# EAGLE design loochi-0.5 (EAGLE 6.2)
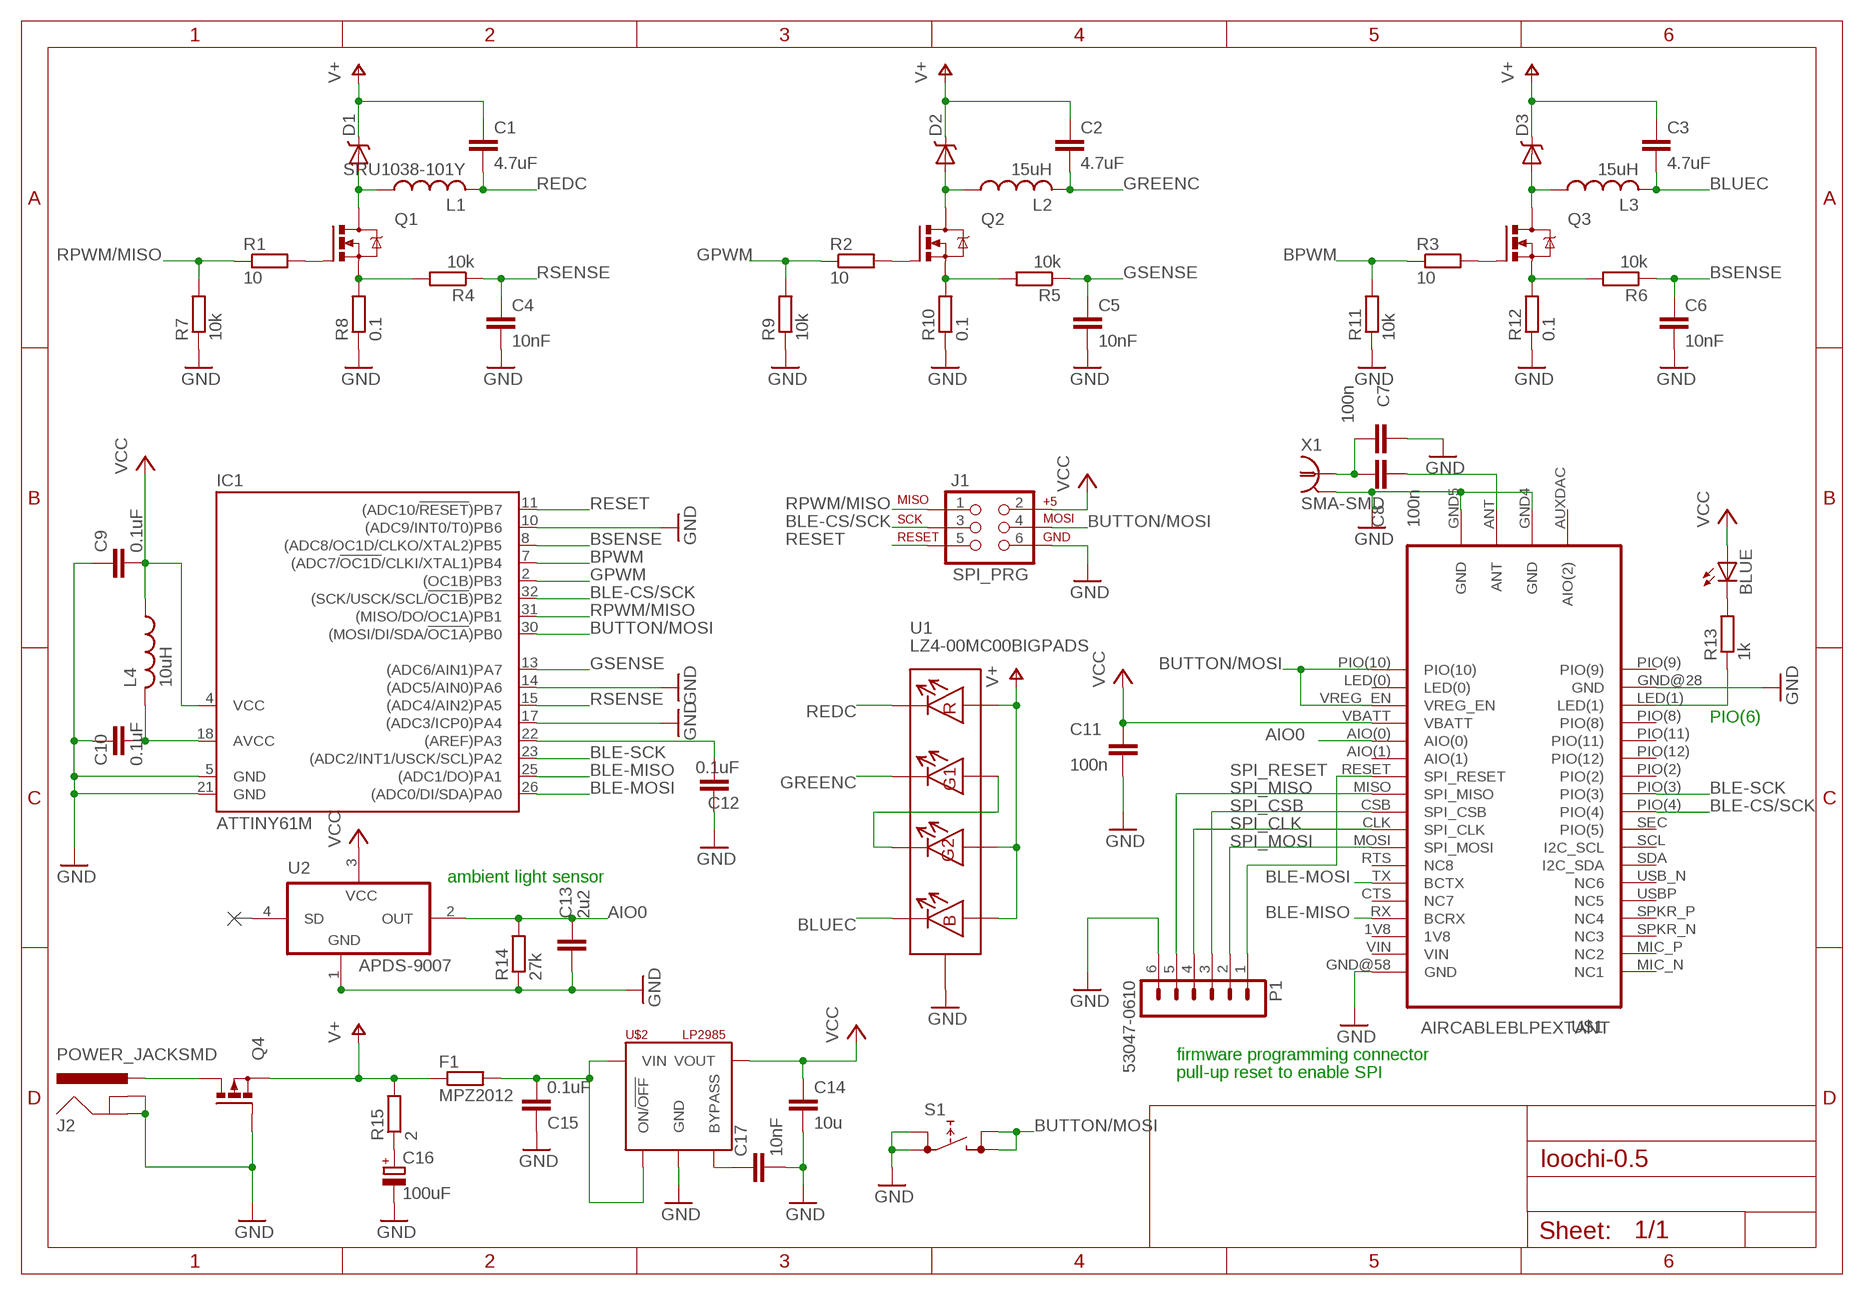
[diagram p0: schematic, sheet 1]

## Parts
BLUE  500003  [CHIPLED_0603]
C1  4.7uF  C-EUC0603  [C0603]
C2  4.7uF  C-EUC0603  [C0603]
C3  4.7uF  C-EUC0603  [C0603]
C4  10nF  C-EUC0603  [C0603]
C5  10nF  C-EUC0603  [C0603]
C6  10nF  C-EUC0603  [C0603]
C7  100n  C-EUC0603  [C0603]
C8  100n  C-EUC0603  [C0603]
C9  0.1uF  C-EUC0603  [C0603]
C10  0.1uF  C-EUC0603  [C0603]
C11  100n  C-EUC0603  [C0603]
C12  0.1uF  C-EUC0603  [C0603]
C13  2u2  C-EUC0603  [C0603]
C14  10u  C-EUC0603  [C0603]
C15  0.1uF  C-EUC0603K  [C0603K]
C16  100uF  CPOL-EUD  [PANASONIC_D]
C17  10nF  C-EUC0603  [C0603]
D1  PMEG4010CEH  DIODE-SCHOTTKY  [SOD123F]
D2  PMEG4010CEH  DIODE-SCHOTTKY  [SOD123F]
D3  PMEG4010CEH  DIODE-SCHOTTKY  [SOD123F]
F1  MPZ2012  R-EU_R0603  [R0603]
IC1  ATTINY61M  [MLF32]
J1  SPI_PRG  AVR_SPI_PRG_6NS  [2X3-NS]
J2  POWER_JACKSMD  [POWER_JACK_SMD]
L1  SRU1038-101Y  L-USBOURNS-SRU1038  [BOURNS-SRU1038]
L2  15uH  L-USBOURNS-SRU1038  [BOURNS-SRU1038]
L3  15uH  L-USBOURNS-SRU1038  [BOURNS-SRU1038]
L4  10uH  L-USL0603  [L0603]
P1  53047-0610  [53047-0610]
Q1  PMN25ENSOT457  [SOT457]
Q2  PMN25ENSOT457  [SOT457]
Q3  PMN25ENSOT457  [SOT457]
Q4  FDC654P  [SUPERSOT6]
R1  10  R-EU_R0603  [R0603]
R2  10  R-EU_R0603  [R0603]
R3  10  R-EU_R0603  [R0603]
R4  10k  R-EU_R0603  [R0603]
R5  10k  R-EU_R0603  [R0603]
R6  10k  R-EU_R0603  [R0603]
R7  10k  R-EU_R0603  [R0603]
R8  0.1  R-EU_R0603  [R0603]
R9  10k  R-EU_R0603  [R0603]
R10  0.1  R-EU_R0603  [R0603]
R11  10k  R-EU_R0603  [R0603]
R12  0.1  R-EU_R0603  [R0603]
R13  1k  R-EU_R0603  [R0603]
R14  27k  R-EU_R0603  [R0603]
R15  2  R-EU_R0603  [R0603]
S1  REKN  [TACTSWITCHHORIZONTAL]
U1  LZ4-00MC00BIGPADS  [LZ4-00MC00-BIGPADS]
U2  APDS-9007  [APDS-9007]
U$1  AIRCABLEBLPEXTANT  [AIRCABLEBLP]
U$2  LP2985  [DBV]
X1  SMA-SMD  [SMA-SMD]

## Nets
AIO0: C13.1 R14.2 U2.2(OUT) U$1.AIO(0)
BLE-CS/SCK: IC1.32((SCK/USCK/SCL/!OC1B!)PB2) J1.3 U$1.PIO(4)
BLE-MISO: IC1.25((ADC1/DO)PA1) U$1.RX(BCRX)
BLE-MOSI: IC1.26((ADC0/DI/SDA)PA0) U$1.TX(BCTX)
BLE-SCK: IC1.23((ADC2/INT1/USCK/SCL)PA2) U$1.PIO(3)
BLUEC: C3.2 L3.P$2 U1.P$8
BPWM: IC1.7((ADC7/!OC1D!/CLKI/XTAL1)PB4) R3.1 R11.2
BSENSE: C6.1 IC1.8((ADC8/OC1D/CLKO/XTAL2)PB5) R6.1
BUTTON/MOSI: IC1.30((MOSI/DI/SDA/!OC1A!)PB0) J1.4 S1.3 S1.4 U$1.PIO(10) U$1.VREG_EN
GND: C4.2 C5.2 C6.2 C7.2 C9.1 C10.1 C11.1 C12.1 C13.2 C14.2 C15.1 C16.- C17.2 IC1.5(GND) IC1.10((ADC9/INT0/T0)PB6) IC1.14((ADC5/AIN0)PA6) IC1.17((ADC3/ICP0)PA4) IC1.21(GND) J1.6 J2.GND(GNDBREAK) J2.P$4(GND) P1.6 Q4.P$3(G) R7.1 R8.1 R9.1 R10.1 R11.1 R12.1 R14.1 S1.1 S1.2 U1.P$9(THERMAL) U1.THERMAL U1.THERMAL1(THERMAL) U1.THERMAL2(THERMAL) U1.THERMAL3(THERMAL) U1.THERMAL4(THERMAL) U1.THERMAL5(THERMAL) U1.THERMAL6(THERMAL) U1.THERMAL7(THERMAL) U1.THERMAL8(THERMAL) U1.THERMAL9(THERMAL) U2.1(GND) U$1.GND4(GND) U$1.GND5(GND) U$1.GND@28(GND) U$1.GND@58(GND) U$2.2(GND) X1.2@1(GND)
GPWM: IC1.2((OC1B)PB3) R2.1 R9.2
GREENC: C2.2 L2.P$2 U1.P$6
GSENSE: C5.1 IC1.13((ADC6/AIN1)PA7) R5.1
N$1: U1.P$2 U1.P$5
N$2: C8.1 U$1.ANT
N$3: Q3.P$3(G) R3.2
N$4: Q2.P$3(G) R2.2
N$5: Q1.P$3(G) R1.2
N$7: Q1.P$4(S) R4.2 R8.2
N$8: D1.P$A(A) L1.P$1 Q1.P$1(D) Q1.P$2(D) Q1.P$5(D) Q1.P$6(D)
N$9: C12.2 IC1.22((AREF)PA3)
N$10: J2.VIN0(PWR) J2.VIN1(PWR) Q4.P$1(D) Q4.P$2(D) Q4.P$5(D) Q4.P$6(D)
N$11: C10.2 IC1.18(AVCC) L4.2
N$12: BLUE.C R13.2
N$13: C17.1 U$2.4(BYPASS)
N$14: D2.P$A(A) L2.P$1 Q2.P$1(D) Q2.P$2(D) Q2.P$5(D) Q2.P$6(D)
N$15: C7.1 C8.2 X1.1
N$16: R13.1 U$1.LED(1)
N$17: Q2.P$4(S) R5.2 R10.2
N$21: C16.+ R15.1
N$22: C15.2 F1.2 U$2.1(VIN) U$2.3(ON/!OFF!)
N$23: D3.P$A(A) L3.P$1 Q3.P$1(D) Q3.P$2(D) Q3.P$5(D) Q3.P$6(D)
N$25: Q3.P$4(S) R6.2 R12.2
REDC: C1.2 L1.P$2 U1.P$4
RESET: IC1.11((ADC10/!RESET!)PB7) J1.5
RPWM/MISO: IC1.31((MISO/DO/OC1A)PB1) J1.1 R1.1 R7.2
RSENSE: C4.1 IC1.15((ADC4/AIN2)PA5) R4.1
SPI_CLK: P1.4 U$1.CLK(SPI_CLK)
SPI_CSB: P1.3 U$1.CSB(SPI_CSB)
SPI_MISO: P1.5 U$1.MISO(SPI_MISO)
SPI_MOSI: P1.2 U$1.MOSI(SPI_MOSI)
SPI_RESET: P1.1 U$1.RESET(SPI_RESET)
V+: C1.1 C2.1 C3.1 D1.P$C(C) D2.P$C(C) D3.P$C(C) F1.1 Q4.P$4(S) R15.2 U1.P$1 U1.P$3 U1.P$7
VCC: BLUE.A C9.2 C11.2 C14.1 IC1.4(VCC) J1.2 L4.1 U2.3(VCC) U$1.VBATT U$2.5(VOUT)
Unconnected: U2.4(SD) U$1.1V8 U$1.AIO(1) U$1.AUXDAC(AIO(2)) U$1.CTS(NC7) U$1.LED(0) U$1.MIC_N(NC1) U$1.MIC_P(NC2) U$1.PIO(2) U$1.PIO(8) U$1.PIO(9) U$1.PIO(11) U$1.PIO(12) U$1.RTS(NC8) U$1.SCL(I2C_SCL) U$1.SDA(I2C_SDA) U$1.SEC(PIO(5)) U$1.SPKR_N(NC3) U$1.SPKR_P(NC4) U$1.USB_N(NC6) U$1.USBP(NC5) U$1.VIN

## Notes on the sheet
- PIO(6)
- ambient light sensor
- firmware programming connector
- pull-up reset to enable SPI

## Power pins joined to a net without a drawn wire
GND: X1.2@2(GND) X1.2@3(GND) X1.2@4(GND) X1.2@5(GND) X1.2@6(GND)

## Library data of the parts
BLUE = WCI:500003: LED OSRAM: - CHIPLED LG R971, LG N971, LY N971, LG Q971, LY Q971, LO R971, LY R971 LH N974, LH R974 LS Q976, LO Q976, LY Q976 LO Q996 - Hyper CHIPLED LW Q18S LB Q993, LB Q99A, LB R99A - SideLED LS A670, LO A670, LY A670, LG A670, LP A670 LB A673, LV A673, LT A673, LW A673 LH A674 LY A675 LS A676, LA A676, LO A676, LY A676, LW A676 LS A679, LY A679, LG A679 - Hyper Micro SIDELED® LS Y876, LA Y876, LO Y876, LY Y876 LT Y87S - SmartLED LW L88C, LW L88S LB L89C, LB L89S, LG L890 LS L89K, LO L89K, LY L89K LS L896, LA L896, LO L896, LY L896 - TOPLED LS T670, LO T670, LY T670, LG T670, LP T670 LSG T670, LSP T670, LSY T670, LOP T670, LYG T670 LG T671, LOG T671, LSG T671 LB T673, LV T673, LT T673, LW T673 LH T674 LS T676, LA T676, LO T676, LY T676, LB T676, LH T676, LSB T676, LW T676 LB T67C, LV T67C, LT T67C, LS T67K, LO T67K, LY T67K, LW E67C LS E67B, LA E67B, LO E67B, LY E67B, LB E67C, LV E67C, LT E67C LW T67C LS T679, LY T679, LG T679 LS T770, LO T770, LY T770, LG T770, LP T770 LB T773, LV T773, LT T773, LW T773 LH T774 LS E675, LA E675, LY E675, LS T675 LS T776, LA T776, LO T776, LY T776, LB T776 LHGB T686 LT T68C, LB T68C - Hyper Mini TOPLED® LB M676 - Mini TOPLED Santana® LG M470 LS M47K, LO M47K, LY M47K Source: http://www.osram.convergy.de/
C1-C6 C9 C10 C12 C14 C15 C17 = rcl:C-EU: CAPACITOR, European symbol
C7 C8 C11 C13 = rcl:C-EU: CAPACITOR, European symbol; PARTNO: *
C16 = rcl:CPOL-EU: POLARIZED CAPACITOR, European symbol
D1-D3 = diode-schottky:DIODE-SCHOTTKY
F1 R1-R15 = rcl:R-EU_: RESISTOR, European symbol
IC1 = attinyx61:ATTINY*61: AtTinyX61; OC_FARNELL: unknown; OC_NEWARK: unknown
J1 = SparkFun:AVR_SPI_PRG_6: AVR ISP 6 Pin This is the reduced ISP connector for AVR programming. Common on Arduino. This footprint will take up less PCB space and can be used with a 10-pin to 6-pin adapter such as SKU: BOB-08508
J2 = SparkFun:POWER_JACK: Power Jack This is the standard 5.5mm barrel jack for power. The PTH is the most common, proven, reliable, footprint. All others are experimental. The Slot footprint only works if the mill layer is transmitted to the PCB fab house so be warned. Spark Fun Electronics SKU : PRT-00119. Mating wall wart : TOL-00298 (and others)
L1-L4 = inductors:L-US: INDUCTOR, American symbol
P1 = con-molex-picoblade:53047-0610: HEADER; PARTNO: *
Q1-Q3 = mosfet:PMN25EN: N-CHANNEL MOS FET
Q4 = mosfet:FDC654P: FDC654P
S1 = AIRcam:REKN: PUSH SWITCH ITT-Cannon-Cannon; PARTNO: *
U1 = ledengin:LZ4-00MC00
U2 = AIRcam:APDS-9007: AMBIENT LIGHT SENSOR; PARTNO: *
U$1 = aircable:AIRCABLEBLP
U$2 = ti-regulators:LP2985
X1 = con-coax:SMA-SMD: SMA 50 Ohm Straight Jack Receptacle - Surface Mount www.johnsoncomponents.com Source: http://catalog.digikey.com .. 142-0711-201, 205, 202, 206.pdf; OC_FARNELL: unknown; OC_NEWARK: unknown

## Board
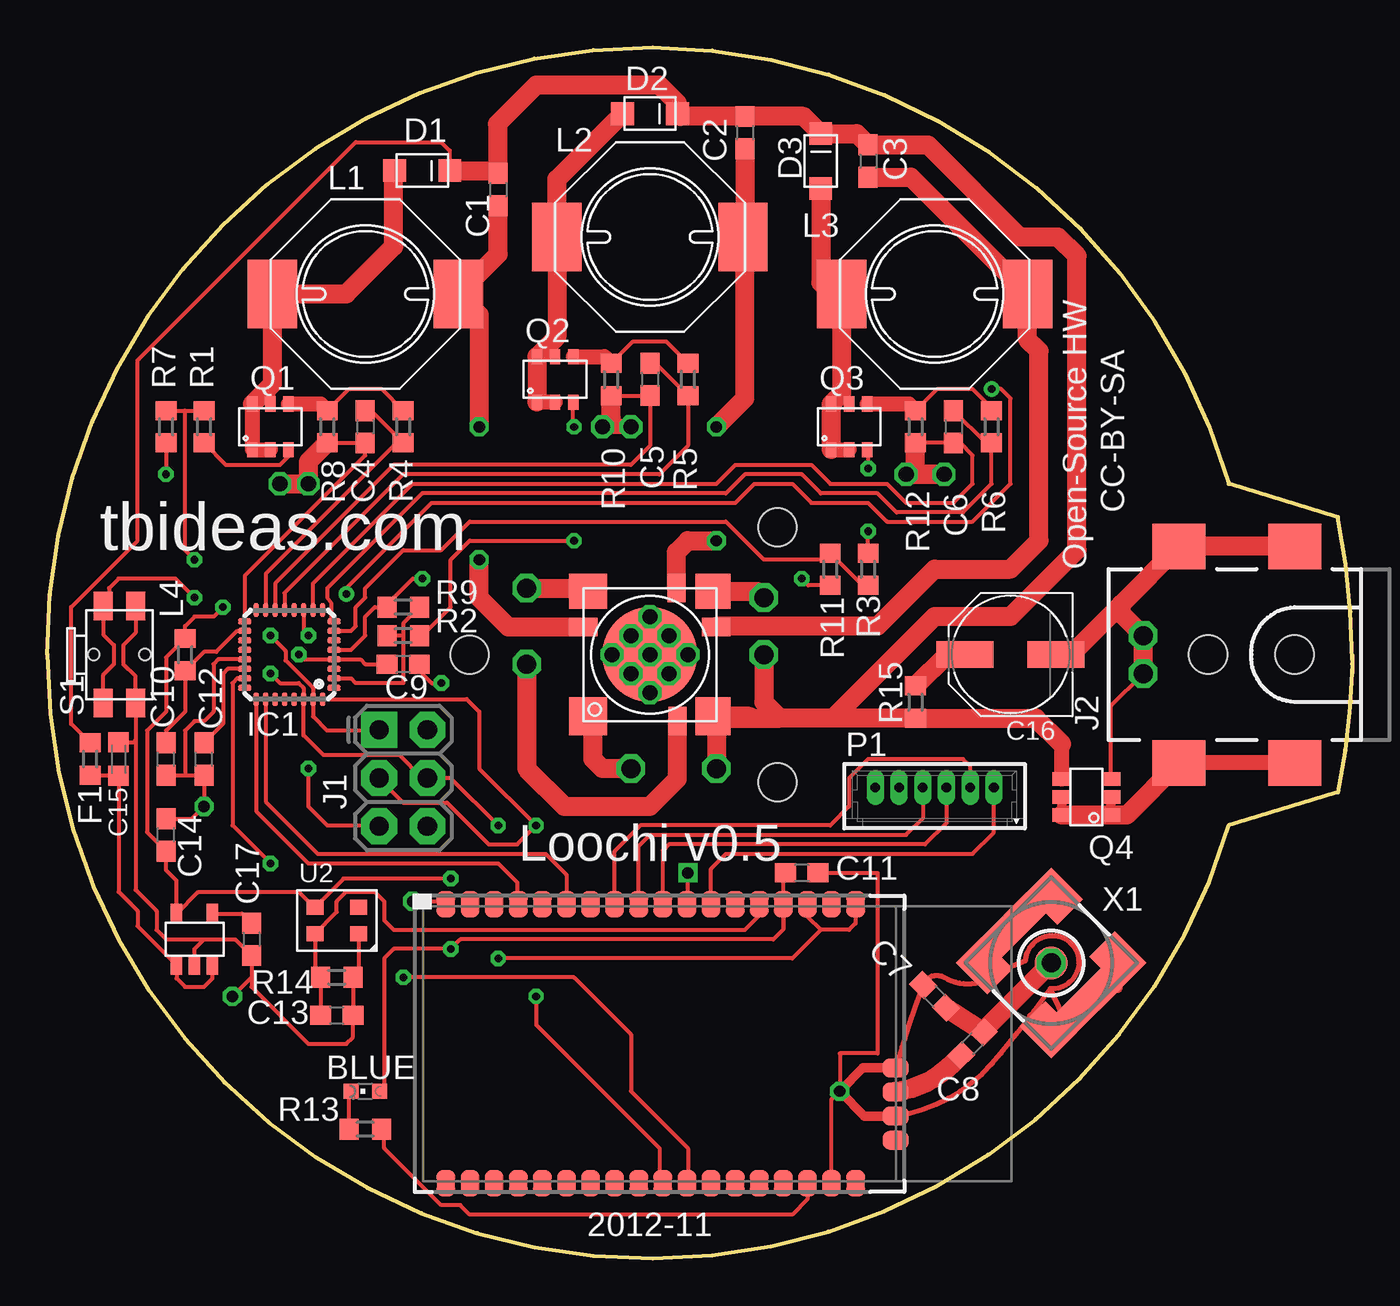
[diagram p1: board, top side]
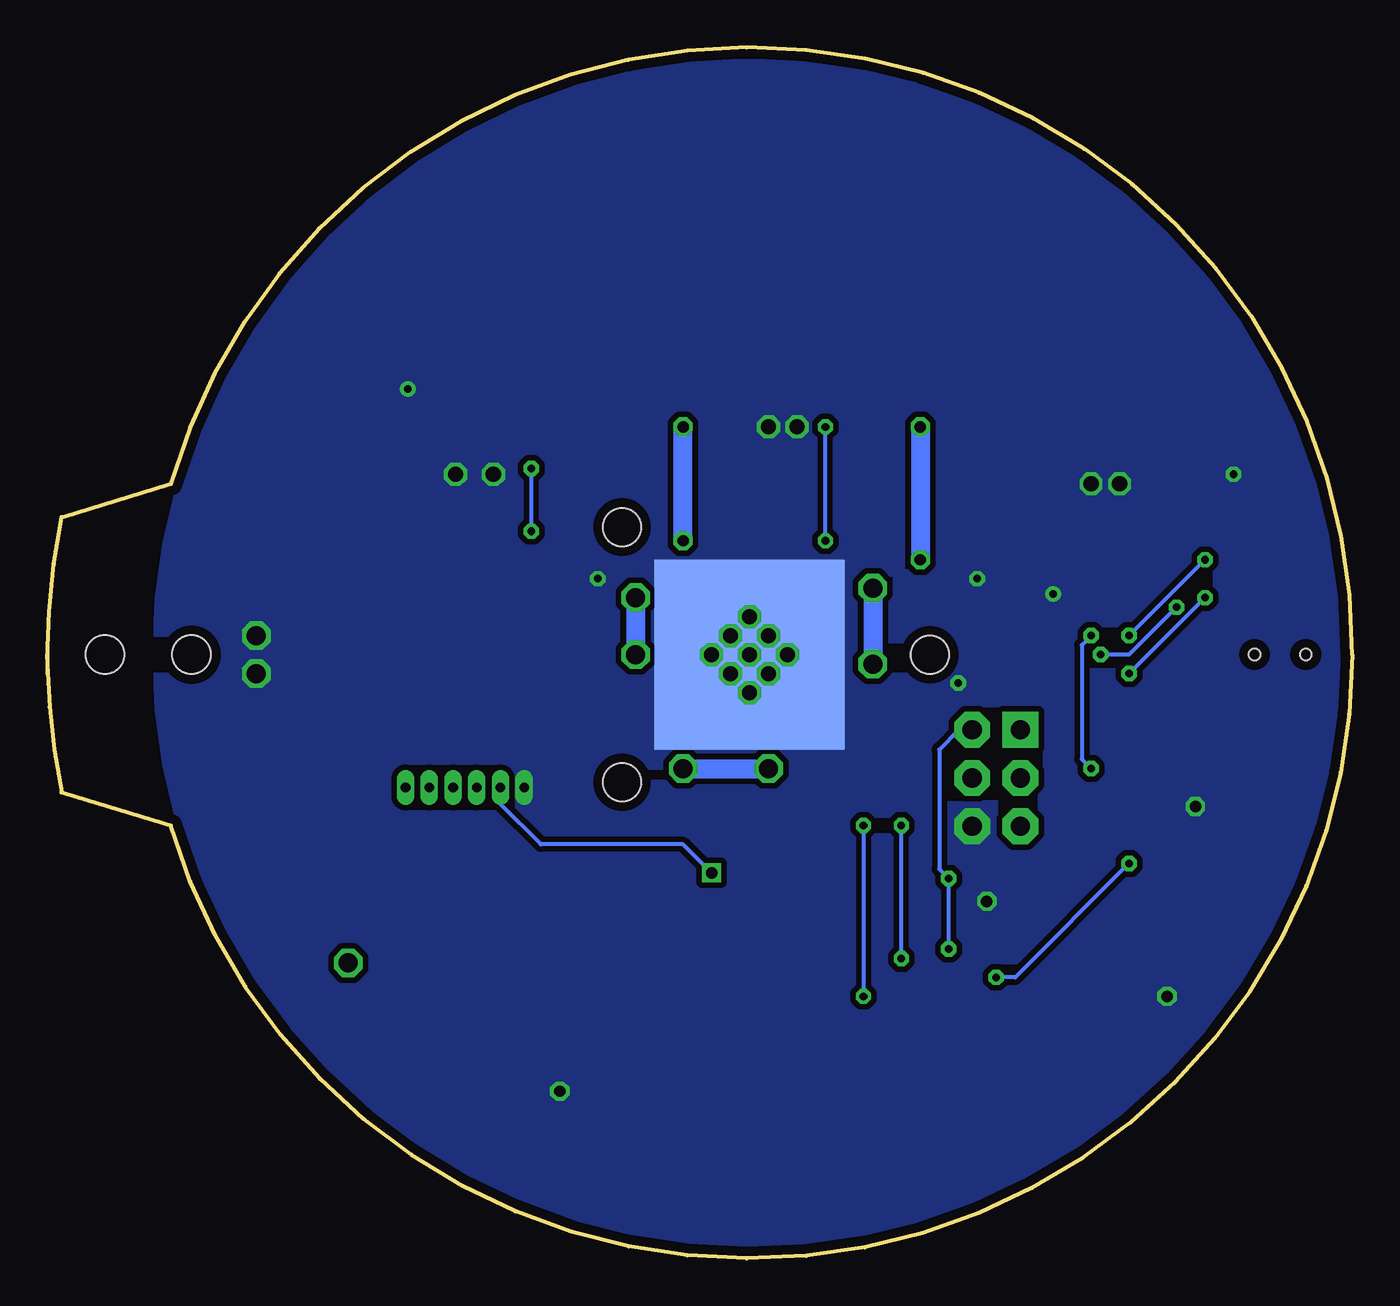
[diagram p2: board, bottom side, seen from below]

Size 68.75 x 63.79 mm. Coordinates in mm from the lower left corner, seen from the top.
Outline: 68.75,31.31 arc-11 68,24.56 62.25,22.81 arc-164 0,31.81 arc-164 62.25,40.81 68,39.06 arc-11 68.75,31.56
Outline: 68.75,31.81 68.75,30.81
Copper layers (1*16): Top 0.0178mm / dielectric 59mil / Bottom 0.0178mm
Design rules: minimum track width 6mil, minimum drill 14mil, track to track 6mil, track to pad 6mil, pad to pad 6mil, via to via 6mil, smd to smd 6mil, copper to edge 20mil, drill to drill 16mil, minimum pad ring 8mil, minimum via ring 8mil, stop-mask expansion 3mil, vias tented up to drill 0mil, thermal gap 10mil
Holes 2 mm at 22.25,31.81 38.47,38.53 38.47,25.09

### Footprints (pad centres in the part's own frame; a part is rotated, then mirrored left to right if it is on the bottom)
CHIPLED_0603 = smd 0.8 x 0.8: A 0,-0.75; C 0,0.75
C0603 = smd 1.1 x 1: 1 -0.85,0; 2 0.85,0
C0603K = smd 1.05 x 1.08: 1 -0.875,0; 2 0.875,0
PANASONIC_D = smd 3 x 1.4: + 2.4,0; - -2.4,0
SOD123F = smd 1.2 x 1.2: P$A -1.45,0; P$C 1.45,0
R0603 = smd 1 x 1.1: 1 -0.85,0; 2 0.85,0
MLF32 = smd 0.7 x 0.3: 1 -2.35,1.75; 2 -2.35,1.25; 3 -2.35,0.75; 4 -2.35,0.25; 5 -2.35,-0.25; 6 -2.35,-0.75; 7 -2.35,-1.25; 8 -2.35,-1.75; 17 2.35,-1.75; 18 2.35,-1.25; 19 2.35,-0.75; 20 2.35,-0.25; 21 2.35,0.25; 22 2.35,0.75; 23 2.35,1.25; 24 2.35,1.75 | smd 0.3 x 0.7: 9 -1.75,-2.35; 10 -1.25,-2.35; 11 -0.75,-2.35; 12 -0.25,-2.35; 13 0.25,-2.35; 14 0.75,-2.35; 15 1.25,-2.35; 16 1.75,-2.35; 25 1.75,2.35; 26 1.25,2.35; 27 0.75,2.35; 28 0.25,2.35; 29 -0.25,2.35; 30 -0.75,2.35; 31 -1.25,2.35; 32 -1.75,2.35
2X3-NS = drill 1.016 pad 1.88 square: 1 -2.54,-1.27 | drill 1.016 pad 1.88 octagon: 2 -2.54,1.27; 3 0,-1.27; 4 0,1.27; 5 2.54,-1.27; 6 2.54,1.27
POWER_JACK_SMD = smd 2.8 x 2.4: GND 0,-5.7; P$4 6.1,-5.7; VIN0 0,5.7; VIN1 6.1,5.7 | hole 2.032: 0,0; 4.572,0
BOURNS-SRU1038 = smd 2.6 x 3.6: P$1 -4.9,0; P$2 4.9,0
L0603 = smd 1 x 1.1: 1 -0.85,0; 2 0.85,0
53047-0610 = drill 0.508 long: 1 3.125,0; 2 1.875,0; 3 0.625,0; 4 -0.625,0; 5 -1.875,0; 6 -3.125,0
SOT457 = smd 0.8 x 0.55: P$1 -1.2,0.95; P$2 -1.2,0; P$3 -1.2,-0.95; P$4 1.2,-0.95; P$5 1.2,0; P$6 1.2,0.95
SUPERSOT6 = smd 0.7 x 1: P$1 -0.95,-1.3; P$2 0,-1.3; P$3 0.95,-1.3; P$4 0.95,1.3; P$5 0,1.3; P$6 -0.95,1.3
TACTSWITCHHORIZONTAL = smd 1.5 x 1: 1 -2.55,2.2; 2 2.55,2.2; 3 -2.55,0.5; 4 2.55,0.5 | hole 0.6: 0,0; 0,2.7
LZ4-00MC00-BIGPADS = smd 1.84 x 2: P$1 -3.33,3.25 | smd 0.96 x 1.5: P$2 -1.45,3.5; P$6 -1.4,-3.5 | smd 2 x 2: P$3 3.25,3.25 | smd 1.5 x 0.96: P$4 3.5,-1.45; P$8 -3.5,-1.45 | smd 2 x 1.84: P$5 3.25,-3.33 | smd 1.84 x 1.84: P$7 -3.33,-3.33 | smd 10 x 10 bottom: P$9 0,0 | smd 5 x 5: THERMAL 0,0 | drill 0.8 octagon: THERMAL1 0,0; THERMAL2 0,2; THERMAL3 1,1; THERMAL4 2,0; THERMAL5 1,-1; THERMAL6 0,-2; THERMAL7 -1,-1; THERMAL8 -2,0; THERMAL9 -1,1
APDS-9007 = smd 0.9 x 0.8: 1 -1.15,0.7; 2 1.15,0.7; 3 1.15,-0.7; 4 -1.15,-0.7
AIRCABLEBLP = smd 1 x 1.4: 1V8 -8.71,7.35; AIO(0) 5.26,7.35; AIO(1) 3.99,7.35; CLK -1.09,7.35; CSB 0.18,7.35; CTS -3.63,7.35; GND@28 9.07,-7.35; GND@58 -11.25,7.35; LED(0) 9.07,7.35; LED(1) 7.8,-7.35; MIC_N -9.98,-7.35; MIC_P -11.25,-7.35; MISO 1.45,7.35; MOSI -2.36,7.35; PIO(2) 2.72,-7.35; PIO(3) 1.45,-7.35; PIO(4) 0.18,-7.35; PIO(8) 6.53,-7.35; PIO(9) 10.34,-7.35; PIO(10) 10.34,7.35; PIO(11) 5.26,-7.35; PIO(12) 3.99,-7.35; RESET 2.72,7.35; RTS -6.17,7.35; RX -7.44,7.35; SCL -2.36,-7.35; SDA -3.63,-7.35; SEC -1.09,-7.35; SPKR_N -7.44,-7.35; SPKR_P -8.71,-7.35; TX -4.9,7.35; USB_N -4.9,-7.35; USBP -6.17,-7.35; VBATT 6.53,7.35; VIN -9.98,7.35; VREG_EN 7.8,7.35 | smd 1.4 x 1: ANT 12.45,-2.54; AUXDAC 12.45,-5.08; GND4 12.45,-1.27; GND5 12.45,-3.81
DBV = smd 0.6 x 1.05: 1 -0.95,-1.35; 2 0,-1.35; 3 0.95,-1.35; 4 0.95,1.35; 5 -0.95,1.35
SMA-SMD = smd 1.73 x 1.73: 1 0,0 | smd 2.35 x 1.9: 2@1 -2.375,2.6; 2@2 -2.375,-2.6; 2@3 2.375,-2.6; 2@4 2.375,2.6 | smd 1.5 x 3.4: 2@5 -2.8,0; 2@6 2.8,0

### Placement (x,y rotation side)
BLUE  16.75,8.81 90 top
C1  23.75,56.31 270 top
C2  36.75,59.31 270 top
C3  43.25,57.81 270 top
C4  16.75,43.81 270 top
C5  31.75,46.31 270 top
C6  47.75,43.81 270 top
C7  46.75,13.81 135 top
C8  48.75,11.31 45 top
C9  18.75,31.31 180 top
C10  6.25,26.31 90 top
C11  39.75,20.31 180 top
C12  8.25,26.31 90 top
C13  15.25,12.81 0 top
C14  6.25,22.31 90 top
C15  3.75,26.31 270 top
C16  50.75,31.81 180 top
C17  10.75,16.81 270 top
D1  19.75,57.31 0 top
D2  31.75,60.31 0 top
D3  40.75,57.81 90 top
F1  2.25,26.31 270 top
IC1  12.75,31.81 180 top
J1  18.75,25.31 270 top
J2  65.73,31.81 180 top
L1  16.75,50.81 0 top
L2  31.75,53.81 0 top
L3  46.75,50.81 0 top
L4  7.25,31.81 270 top
P1  46.75,24.81 0 top
Q1  11.75,43.81 90 top
Q2  26.75,46.31 90 top
Q3  42.25,43.81 90 top
Q4  54.75,24.31 90 top
R1  8.25,43.81 270 top
R2  18.75,32.81 0 top
R3  43.25,36.31 90 top
R4  18.75,43.81 90 top
R5  33.75,46.31 90 top
R6  49.75,43.81 90 top
R7  6.25,43.81 90 top
R8  14.75,43.81 90 top
R9  18.75,34.31 0 top
R10  29.71,46.3 90 top
R11  41.25,36.31 90 top
R12  45.75,43.81 90 top
R13  16.75,6.81 180 top
R14  15.25,14.81 180 top
R15  45.75,29.31 270 top
S1  2.44,31.81 270 top
U1  31.75,31.81 180 top
U2  15.25,17.81 180 top
U$1  32.25,11.31 0 top
U$2  7.75,16.81 0 top
X1  52.9,15.57 135 top

### Tracks (layer width: path | path; a pad name or v marks a point on that pad's centre or on a via)
AIO0
  Top 0.2: C13.1 R14.2 14.1,15.11 U2.2 15.25,18.26 15.25,18.81 15.75,19.31 17.25,19.31 17.75,18.81 17.75,17.81 18.25,17.31 36.75,17.31 37.51,18.07 U$1.AIO(0) 37.25,18.4
BLE-CS/SCK  (via drill 0.4)
  Top 0.2: IC1.32 22.1,29.46 22.75,28.81 22.75,25.81 v25.75,22.81 24.75,21.81 23.25,21.81 21.05,24.01 18.75,24.01 17.48,25.28 J1.3 | v25.75,13.81 25.75,12.31 32.25,5.81 32.25,4.14 U$1.PIO(4)
  Bottom 0.2: v25.75,22.81 v25.75,13.81
BLE-MISO
  Top 0.2: IC1.25 11,23.56 13.75,20.81 23.75,20.81 24.75,19.81 24.75,18.72 U$1.RX
BLE-MOSI
  Top 0.2: IC1.26 11.5,24.06 14.25,21.31 26.25,21.31 27.35,20.21 U$1.TX
BLE-SCK  (via drill 0.4)
  Top 0.2: IC1.23 10,30.56 9.75,30.31 9.75,22.81 v11.75,20.81 | U$1.PIO(3) 33.75,4.01 33.75,5.81 30.75,8.81 30.75,11.81 27.75,14.81 v18.75,14.81
  Bottom 0.2: v11.75,20.81 17.75,14.81 v18.75,14.81
BLUEC
  Top 1: U1.P$8 35.3,33.31 43.75,33.31 46.75,36.31 50.75,36.31 52.25,37.81 52.25,47.81 51.65,48.41 L3.P$2 45.5,56.96 C3.2
BPWM
  Top 0.2: IC1.7 16,33.06 16.25,33.31 16.25,34.31 16.75,34.81 16.75,35.31 18.75,37.31 20.75,37.31 22.25,38.81 35.75,38.81 37.75,36.81 40.9,36.81 R11.2 42.95,35.46 R3.1
BSENSE
  Top 0.2: C6.1 49.45,42.96 R6.1 49.75,40.81 48.25,39.31 44.75,39.31 43.75,40.31 40.75,40.31 39.75,41.31 36.75,41.31 35.75,40.31 19.75,40.31 14.75,35.31 14.75,34.81 14.95,34.51 14.95,33.61 15.05,33.61 IC1.8
BUTTON/MOSI  (via drill 0.4)
  Top 0.2: 40.75,17.31 40.05,18.01 U$1.VREG_EN | IC1.30 13.5,29.56 | v7.75,34.81 6.75,35.81 3.75,35.81 3.25,35.31 3.25,34.67 S1.3 2.94,32.87 3.5,32.31 3.5,31.31 2.94,30.75 S1.4 | 40.75,17.31 39.25,15.81 v23.75,15.81 | v23.75,22.81 21.25,25.31 J1.4 19.75,25.31 18.55,26.51 14.55,26.51 13.5,27.56 IC1.30 | 13.5,29.76 IC1.30 | U$1.PIO(10) 42.59,17.65 42.25,17.31 40.75,17.31 | v11.75,30.81 12.25,30.31 13.25,30.31 13.5,30.06 IC1.30
  Bottom 0.2: v11.75,30.81 v7.75,34.81 | v23.75,15.81 v23.75,22.81
GND  (via drill 0.4, 0.6, 0.8, 1)
  Top 0.2: R10.1 C5.2 31.75,42.81 30.75,41.81 18.25,41.81 12,35.56 IC1.14 | R8.1 C4.2 16.75,42.31 10.4,35.96 IC1.17 | 7.25,25.46 C12.1 v8.25,23.81 7.6,23.16 C14.2 | 7.25,25.46 7.25,27.81 7.75,28.31 8.25,28.31 8.75,28.81 8.75,31.31 9,31.56 IC1.21 | C10.1 7.25,25.46 | IC1.10 14,35.56 19.25,40.81 35.25,40.81 36.25,41.81 40.25,41.81 41.25,40.81 44.25,40.81 45.25,39.81 47.75,39.81 48.75,40.81 48.75,42.31 48.1,42.96 C6.2 R12.1 | U$2.2 7.75,16.31 8.25,16.81 | 8.25,16.81 9.9,16.81 C17.2 10.75,14.81 | U2.1 16.4,15.11 R14.1 C13.2 16.1,11.66 15.75,11.31 13.75,11.31 10.75,14.31 10.75,14.81 | 56.59,34.31 56.59,34.47 | 57.29,30.35 v57.75,30.81 56.05,29.11 Q4.P$3 | R7.1 v6.25,41.31 | R11.1 40.1,35.46 v39.75,35.81 | v9.75,13.81 10.75,14.81 | 8.25,16.81 6.25,16.81 5.75,17.31 5.75,18.31 4.64,19.42 4.64,27.31 | v19.25,18.81 20.85,18.81 U$1.GND@58 | U$1.GND@28 41.32,8.38 v41.75,8.81 41.75,10.81 43.75,10.81 43.75,20.31 C11.1 | 4.64,27.31 S1.2 4.64,30.67 4,31.31 4,32.31 4.64,32.95 S1.1 | C15.1 4.51,27.18 arc90 4.64,27.31 | C9.1 19.75,31.16 19.75,30.81 20.25,30.31 v20.75,30.31 | 19.4,35.81 v19.75,35.81 19.25,35.81 17.75,34.31 | IC1.5 16,32.06 16.75,32.81 16.75,33.81 17.25,34.31 17.75,34.31 | v15.75,35.01 15.75,35.31 20.25,39.81 36.25,39.81 37.25,40.81 39.25,40.81 40.25,39.81 43.25,39.81 44.25,38.81 48.75,38.81 50.75,40.81 50.75,45.31 50.25,45.81 v49.75,45.81 | 17.75,34.31 R9.1 | X1.2@4 49.38,15.18 49.75,14.81
  Top 0.254: U$1.GND5 arc43 50.25,10.81 arc4 52.85,14.21 | U$1.GND4 arc-4 45.75,13.31 C7.2 arc-100 47.25,14.81 arc60 49.75,14.81 arc-7 51.55,15.71 arc-270 52.85,14.21 | 51.75,12.81 53.5,12.81 52.85,14.21 | X1.2@4 49.58,15.61
  Top 0.5: U$1.GND4 42.98,10.04 v41.75,8.81 43.06,7.5 U$1.GND5 | 49,15.41 X1.2@4 49.38,16.01 X1.2@6 51.52,17.55 X1.2@3 | X1.2@1 53.5,12.81 54.28,13.59 X1.2@5 56.42,15.13 X1.2@2 56.42,14.23
  Top 0.8: v30.75,43.81 v29.25,43.81
  Top 1: J2.GND J2.P$4 56.59,34.47 53.93,31.81 C16.- | v12.25,40.81 v13.75,40.81 13.75,41.96 R8.1 | v57.75,30.81 v57.75,32.81 56.59,33.97 56.59,34.31 | v29.25,43.81 29.71,44.27 R10.1 | R12.1 45.75,41.31 v47.25,41.31 v45.25,41.31
  Bottom 0.2: U1.THERMAL7 U1.THERMAL8 | U1.THERMAL9 U1.P$9 U1.THERMAL5 U1.THERMAL4 U1.THERMAL3 U1.THERMAL2
  pour Bottom (isolate 0.3, no thermals): 0.75,31.81 arc-90 31.75,62.81 arc-90 62.75,31.81 arc-90 31.75,0.81 arc-90
GPWM
  Top 0.2: IC1.2 16,30.56 16.25,30.31 18.75,30.31 18.75,32.81 | 18.1,32.81 R2.1 18.75,32.81 | R9.2 18.75,33.46 18.75,32.81
GREENC  (via drill 0.6)
  Top 1: C2.2 36.75,53.91 L2.P$2 36.75,53.71 36.75,45.31 v35.25,43.81 | U1.P$6 33.15,37.21 33.75,37.81 v35.25,37.81
  Bottom 1: v35.25,37.81 v35.25,43.81
GSENSE
  Top 0.2: C5.1 32.05,47.16 R5.1 33.75,42.81 32.25,41.31 18.75,41.31 12.5,35.06 IC1.13
N$1  (via drill 1)
  Top 1: v25.25,31.31 25.25,25.81 27.25,23.81 31.75,23.81 33.2,25.26 U1.P$2 | v25.25,35.31 28.33,35.31 U1.P$5
  Bottom 1: v25.25,35.31 v25.25,31.31
N$2
  Top 1: U$1.ANT 44.7,8.81
  Top 1.016: C8.1 47.75,10.31 arc-36 U$1.ANT
N$3  (via drill 0.4)
  Top 0.2: R3.2 v43.25,38.31 | Q3.P$3 43.25,42.56 v43.25,41.61
  Bottom 0.2: v43.25,38.31 v43.25,41.61
N$4  (via drill 0.4)
  Top 0.2: v27.75,37.81 22.25,37.81 21.25,36.81 21.25,34.31 19.75,32.81 R2.2 | v27.75,43.81 27.7,43.86 Q2.P$3
  Bottom 0.2: v27.75,37.81 v27.75,43.81
N$5
  Top 0.2: R1.2 9.4,41.81 12.25,41.81 12.7,42.26 Q1.P$3
N$7
  Top 0.2: R8.2 15.9,45.81 17.6,45.81 R4.2
  Top 0.8: R8.2 14.4,45.01 Q1.P$4
N$8
  Top 0.5: Q1.P$5 11.75,47.71
  Top 0.8: 11.75,47.71 11.85,47.81 | Q1.P$6 Q1.P$1 Q1.P$2 | 18.25,57.26 D1.P$A
  Top 1: Q1.P$6 11.85,46.06 11.85,47.81 L1.P$1 15.75,50.81 18.25,53.31 18.25,57.26
N$9
  Top 0.2: IC1.22 9.5,31.06 9.25,30.81 9.25,28.16 C12.2
N$10
  Top 0.5: Q4.P$5 Q4.P$6 | Q4.P$2 Q4.P$1
  Top 0.8: J2.VIN0 J2.VIN1
  Top 1: J2.VIN1 56.88,23.36 Q4.P$1 Q4.P$6
N$11
  Top 0.2: IC1.18 10,33.06 8.9,31.96 8.25,31.96 L4.2 7.25,28.81 6.25,27.81 C10.2
N$12
  Top 0.2: R13.2 15.9,8.71 BLUE.C
N$13
  Top 0.2: U$2.4 10.25,18.16 C17.1
N$14
  Top 0.5: Q2.P$5 Q2.P$6
  Top 0.8: Q2.P$2 Q2.P$1
  Top 1: D2.P$A 26.85,56.86 L2.P$1 26.85,48.56 Q2.P$6 Q2.P$1
N$15  (via drill 1)
  Top 0.2: 49.35,12.02 arc90 C8.2
  Top 1.016: 49.35,12.02 X1.1 | C7.1 C8.2
  other vias: 52.9,15.57
N$16
  Top 0.2: U$1.LED(1) 40.05,3.11 39.25,2.31 22.25,2.31 21.75,2.81 20.75,2.81 17.75,5.81 17.75,6.66 R13.1
N$17
  Top 0.2: R10.2 30.87,48.31 32.6,48.31 R5.2
  Top 0.8: R10.2 29.35,47.51 Q2.P$4
N$21
  Top 1: R15.1 47.4,31.81 C16.+
N$22
  Top 0.2: U$2.3 8.7,14.76 8.25,14.31 7.25,14.31 6.8,14.76 U$2.1 4.75,17.51 4.75,18.31 3.75,19.31 C15.2 3.73,25.46 F1.2
N$23
  Top 0.5: 41.85,45.56 41.85,45.41 Q3.P$5
  Top 0.8: Q3.P$1 Q3.P$2
  Top 1: L3.P$1 41.85,50.31 | 41.85,50.31 41.85,45.56 Q3.P$6 Q3.P$1 | D3.P$A 40.75,51.41 41.85,50.31
N$25
  Top 0.2: R12.2 46.9,45.81 48.75,45.81 49.75,44.81 R6.2
  Top 0.8: R12.2 45.4,45.01 Q3.P$4
REDC  (via drill 0.6)
  Top 1: C1.2 23.75,52.91 21.75,50.91 L1.P$2 22.75,49.71 v22.75,43.81 | U1.P$4 24.3,33.26 22.75,34.81 v22.75,36.81
  Bottom 1: v22.75,43.81 v22.75,36.81
RESET  (via drill 0.4)
  Top 0.2: IC1.11 13.5,32.81 v13.75,32.81 | v13.75,25.81 13.75,23.81 14.75,22.81 17.44,22.81 J1.5
  Bottom 0.2: v13.75,32.81 14.25,32.31 14.25,26.31 v13.75,25.81
RPWM/MISO  (via drill 0.4)
  Top 0.2: R7.2 7.25,44.66 | 7.25,44.66 R1.1 | J1.1 17.44,27.81 14.75,27.81 14,28.56 IC1.31 14,30.06 12.55,31.51 12.55,32.01 v11.75,32.81 | v7.75,36.81 7.25,37.31 7.25,44.66
  Bottom 0.2: v11.75,32.81 v7.75,36.81
RSENSE
  Top 0.2: C4.1 17.05,44.66 R4.1 18.4,42.96 11.5,36.06 IC1.15
SPI_CLK
  Top 0.2: U$1.CLK 31.16,21.72 31.75,22.31 45.25,22.31 46.12,23.18 P1.4
SPI_CSB
  Top 0.2: P1.3 47.38,22.93 46.25,21.81 32.75,21.81 32.43,21.49 U$1.CSB
SPI_MISO  (via drill 0.6)
  Top 0.2: U$1.MISO 33.75,18.71 v33.75,20.31
  Bottom 0.2: v33.75,20.31 35.25,21.81 42.75,21.81 44.88,23.93 P1.5
SPI_MOSI
  Top 0.2: P1.2 48.62,25.93 48.25,26.31 43.25,26.31 42.25,25.31 42.25,23.81 41.25,22.81 31.25,22.81 29.89,21.45 U$1.MOSI
SPI_RESET
  Top 0.2: U$1.RESET 34.97,20.53 35.75,21.31 48.75,21.31 49.88,22.43 P1.1
V+  (via drill 1)
  Top 0.2: D1.P$C 21.2,58.36 20.75,58.81 16.25,58.81 4.75,47.31 4.75,37.81 1.25,34.31 1.25,28.16 F1.1
  Top 0.8: D2.P$C 33.2,60.86 | Q4.P$4 53.45,27.11
  Top 1: U1.P$1 35.25,28.39 v35.25,25.81 | v30.75,25.81 29.25,25.81 28.75,26.31 28.75,28.31 U1.P$3 | U1.P$7 37.42,35.14 v37.75,34.81 | 33.2,60.86 32.25,61.81 25.75,61.81 23.7,59.76 23.75,59.71 C1.1 23.6,57.31 D1.P$C | v37.75,31.81 37.75,29.31 38.6,28.46 | 37,28.56 U1.P$1 | 38.6,28.46 35.18,28.46 U1.P$1 | 41.4,28.46 46.75,33.81 50.75,33.81 54.25,37.31 54.25,52.81 53.25,53.81 51.25,53.81 46.4,58.66 C3.1 42.65,59.26 D3.P$C 39.85,60.16 C2.1 33.35,60.16 D2.P$C | 41.4,28.46 38.6,28.46 | 41.4,28.46 R15.2 52.1,28.46 53.45,27.11
  Bottom 1: v35.25,25.81 v30.75,25.81 | v37.75,34.81 v37.75,31.81
VCC  (via drill 0.4)
  Top 0.2: C9.2 16.75,31.31 16.5,31.56 IC1.4 13.5,31.56 v13.25,31.81 | 38.78,18.34 38.75,18.31 38.75,17.31 | 38.75,17.31 38.25,16.81 21.75,16.81 v21.25,16.31 18.25,16.31 17.75,15.81 17.75,9.06 BLUE.A | v21.25,20.01 15.6,20.01 U2.3 14.05,18.51 13.25,19.31 7.95,19.31 U$2.5 6.8,19.91 6.25,20.46 C14.1 5.25,22.46 5.25,27.81 6.25,28.81 6.25,31.66 L4.1 7.25,33.31 7.75,33.81 8.75,33.81 v9.25,34.31 | 38.75,17.31 38.78,17.34 U$1.VBATT 38.78,20.31 C11.2
  Bottom 0.2: v21.25,16.31 v21.25,20.01 21.75,20.51 21.75,26.81 20.71,27.85 J1.2 | v9.25,34.31 11.75,31.81 v13.25,31.81

### Text on the board
tPlace: CC-BY-SA | tbideas.com | Open-Source HW | Loochi v0.5 | 2012-11